# Altium schematic sheet RN2483.SchDoc: RN2483 Radio
size A; Date: 2022-02-22; CompanyName: CUInSpace; DrawnBy: Matteo Golin; Engineer: Matteo Golin; Organization: CUInSpace; Revision: B; SheetNumber: 1; SheetTotal: 4
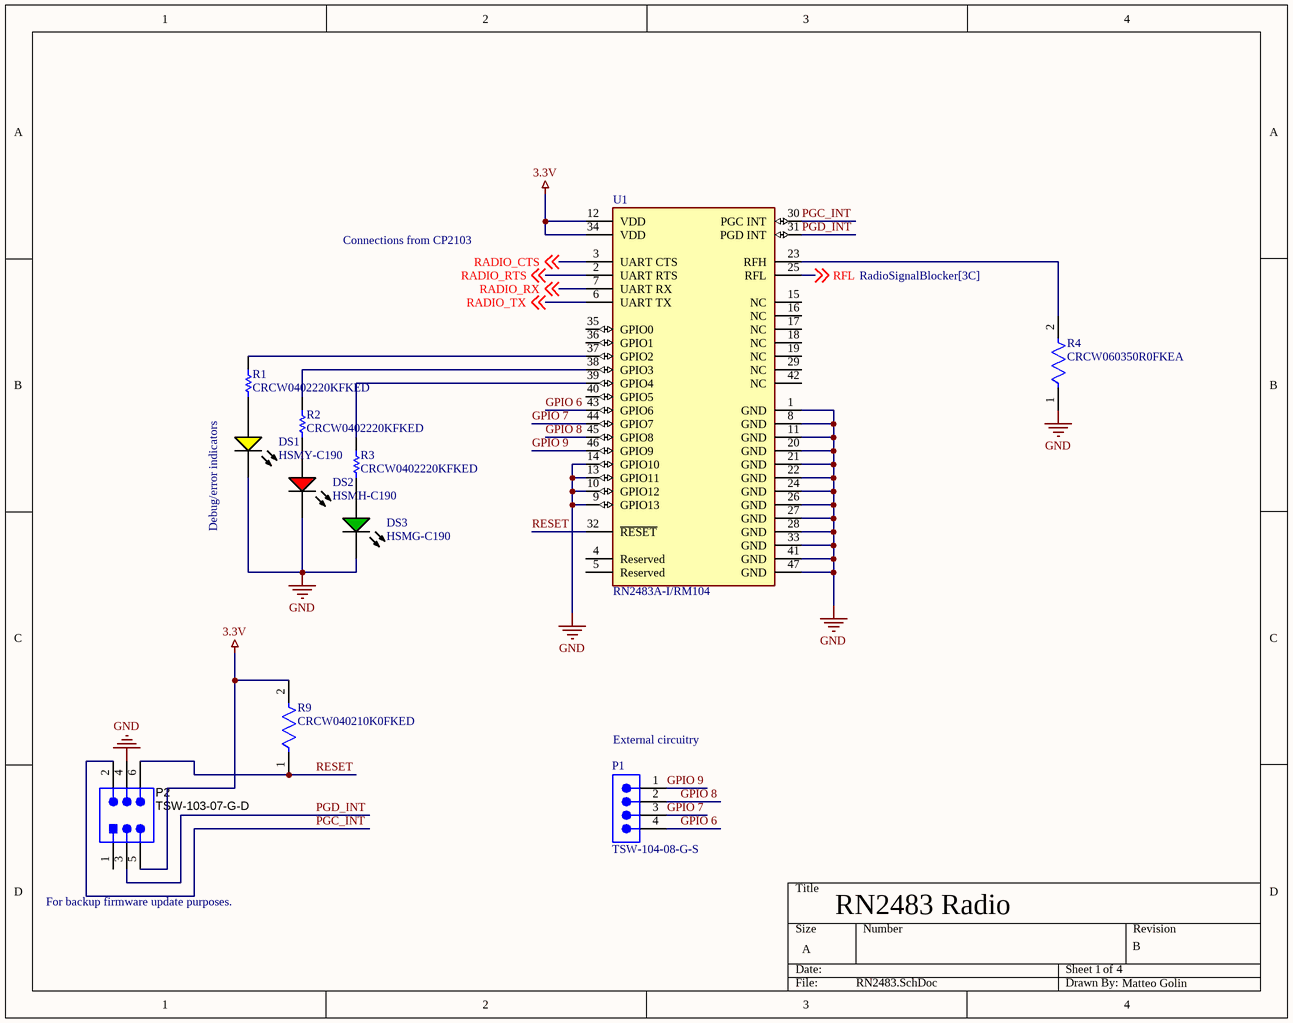
[diagram p0: RN2483.SchDoc]

## Parts
DS1  HSMY-C190  [AVAG-HSMX-C190_V]
DS2  HSMH-C190  [AVAG-HSMX-C190_V]
DS3  HSMG-C190  [AVAG-HSMX-C190_V]
P1  TSW-104-08-G-S  [SMTC-TSW-104-08-X-S]
P2  TSW-103-07-G-D  [SMTC-TSW-103-07-G-D_V]
R1  CRCW0402220KFKED  [RESC1005X40X25LL05T05]
R2  CRCW0402220KFKED  [RESC1005X40X25LL05T05]
R3  CRCW0402220KFKED  [RESC1005X40X25LL05T05]
R4  CRCW060350R0FKEA  [FP-CRCW0603-e3-MFG]
R9  CRCW040210K0FKED  [FP-CRCW0402-e3-IPC_B]
U1  RN2483A-I/RM104  [FP-RN2483A-I-RM104-MFG]

## Nets
3.3V: P2.5 R9.2 U1.12(VDD) U1.34(VDD)
GND: DS1.2(K) DS2.2(K) DS3.2(K) P2.4 R4.1 U1.1(GND) U1.8(GND) U1.9(GPIO13) U1.10(GPIO12) U1.11(GND) U1.13(GPIO11) U1.14(GPIO10) U1.20(GND) U1.21(GND) U1.22(GND) U1.24(GND) U1.26(GND) U1.27(GND) U1.28(GND) U1.33(GND) U1.41(GND) U1.47(GND)
GPIO 6: P1.4 U1.43(GPIO6)
GPIO 7: P1.3 U1.44(GPIO7)
GPIO 8: P1.2 U1.45(GPIO8)
GPIO 9: P1.1 U1.46(GPIO9)
PGC_INT: P2.2 U1.30(PGC_INT)
PGD_INT: P2.3 U1.31(PGD_INT)
RADIO_CTS: U1.3(UART_CTS) ; off-sheet RADIO_CTS
RADIO_RTS: U1.2(UART_RTS) ; off-sheet RADIO_RTS
RADIO_RX: U1.7(UART_RX) ; off-sheet RADIO_RX
RADIO_TX: U1.6(UART_TX) ; off-sheet RADIO_TX
RESET: P2.6 R9.1 U1.32(~{RESET})
RFL: U1.25(RFL) ; off-sheet RFL
NetDS1_1: DS1.1(A) R1.1
NetDS2_1: DS2.1(A) R2.1
NetDS3_1: DS3.1(A) R3.1
NetR1_2: R1.2 U1.37(GPIO2)
NetR2_2: R2.2 U1.38(GPIO3)
NetR3_2: R3.2 U1.39(GPIO4)
NetR4_2: R4.2 U1.23(RFH)

Not connected (* = marked no-connect by the designer): P2 1; U1 4(Reserved) 5(Reserved) 15(NC) 16(NC) 17(NC) 18(NC) 19(NC) 29(NC) 35(GPIO0) 36(GPIO1) 40(GPIO5) 42(NC)

## Notes on the sheet
- Connections from CP2103
- Debug/error indicators
- (near P1) External circuitry
- Type @ to refer to a designator or a net
- For backup firmware update purposes.

## Library data of the parts
DS1 = CMP-1744-00003-1: LED Uni-Color Yellow, 65 mW, 20 mA, -40 to 85 degC, 2-Pin SMD, RoHS, Tape and Reel; Tolerance: 1%; Voltage Rating: 50 V; Power Rating: 100 mW; Case\Package: 0603; Resistance: 390 Ohm; Min Operating Temperature: -55 degC; Length: 1.6 mm; ComponentLink3Description: Package Specification; Mount: Surface Mount; PackageReference: HSMX-C190; ComponentLink2Description: Datasheet; DatasheetVersion: Mar-12; Case Code (Metric): 1608; Pins: 2; Package Quantity: 5000; ComponentLink2URL: http://docs.avagotech.com/docs/AV02-0551EN; ComponentLink1Description: Manufacturer URL; RoHSCompliant: true; Packaging: Tape and Reel; PackageDescription: 2-Pin Surface Mount Device, Body 1.6 x 0.8 mm, Height 0.9 mm; REACH SVHC: No SVHC; ComponentLink3URL: http://www.fairchildsemi.com/dwg/MA/MA03D.pdf; Voltage Rating (DC): 50 V; Width: 0.8 mm; ComponentLink1URL: http://www.avagotech.com/; Max Operating Temperature: 155 degC; Case Code (Imperial): 0603; Height: 0.45 mm
DS2 = CMP-1744-00004-1: LED Uni-Color Red, 65 mW, 20 mA, -40 to 85 degC, 2-Pin SMD, RoHS, Tape and Reel; Connector Type: USB; Gender: Male; Current Rating: 1 A; Length: 7.5 mm; Lead Pitch: 0.65 mm; PackageReference: HSMX-C190; Package Quantity: 2000; Max Operating Temperature: 85 degC; PackageDescription: 2-Pin Surface Mount Device, Body 1.6 x 0.8 mm, Height 0.9 mm; ComponentLink3Description: Package Specification; Mount: Surface Mount; Min Operating Temperature: -30 degC; ComponentLink3URL: http://www.fairchildsemi.com/dwg/MA/MA03D.pdf; ComponentLink1Description: Manufacturer URL; Contact Material: Copper; Pins: 5; Width: 5.6 mm; ComponentLink2Description: Datasheet; RoHSCompliant: true; DatasheetVersion: Mar-12; Height: 2.8 mm; Packaging: Tape and Reel; Contact Plating: Gold; ComponentLink1URL: http://www.avagotech.com/; REACH SVHC: No SVHC; ComponentLink2URL: http://docs.avagotech.com/docs/AV02-0551EN
DS3 = CMP-1744-00002-1: Chip LED, Green, 2.2 V, -40 to 85 degC, 2-Pin SMD, RoHS, Tape and Reel; Frequency: 400 KHz; Max Supply Voltage: 5.5 V; Access Time: 3500 ns; Clock Frequency: 100 KHz; Case\Package: SOIC; Density: 32 kb; Nominal Supply Current: 2 mA; Interface: Serial; Min Supply Voltage: 1.7 V; Packaging: Tape and Reel; PackageReference: HSMX-C190; ComponentLink2URL: http://docs.avagotech.com/docs/AV02-0551EN; RoHSCompliant: true; Pins: 8; REACH SVHC: No SVHC; Max Operating Temperature: 85 degC; Width: 4 mm; Radiation Hardening: No; Package Quantity: 3000; ComponentLink3Description: Package Specification; ComponentLink1Description: Manufacturer URL; Min Operating Temperature: -40 degC; PackageDescription: 2-Pin Surface Mount Device, Body 1.6 x 0.8 mm, Height 0.9 mm; Max Clock Frequency: 100 KHz; Height: 1.5 mm; ComponentLink1URL: http://www.avagotech.com/; DatasheetVersion: Mar-12; ComponentLink2Description: Datasheet; Mount: Surface Mount; Length: 5 mm; ComponentLink3URL: http://www.fairchildsemi.com/dwg/MA/MA03D.pdf
P1 = CMP-1024-00357-1: 0.025" SQ Post Header, Through-hole, Vertical, -55 to 125 degC, 2.54 mm Pitch, 4-Pin, Male, RoHS; Manufacturer: Samtec; Pitch: 2.54 mm; RoHS: True; ComponentLink3URL: http://www.samtec.com/documents/webfiles/cpdf/TSW-XXX-XX-XXX-X-XX-XXX-MKT.pdf; Mounting Technology: Through-hole; ComponentLink2URL: http://www.samtec.com/documents/webfiles/pdf/TSW_TH.PDF; ComponentLink1URL: http://www.samtec.com; ComponentLink3Description: Package Specification; PackageVersion: DM, 8/1988; ComponentLink2Description: Datasheet; PackageReference: TSW-104-08-X-S; PackageDescription: .025[0.64] SQ. Post Terminal Strip Assembly; PartNumber: TSW-104-08-G-S; ComponentLink1Description: Manufacturer URL; Temperature Range: -55 to 125 degC; DatasheetVersion: F-214; Orientation: Vertical
P2 = CMP-2000-07329-1: Through Hole Header, Pitch 2.54 mm, 2 x 3 Position, Height 8.58 mm, Tail Length 2.54 mm, -55 to 125 degC, RoHS, Bulk; Manufacturer: Samtec-Inc.; Number of Positions Loaded: All; Number of Positions: 6; Row Spacing: 0.100"(2.54mm); Connector Type: Header,Unshrouded; Package Reference: TSW-103-07-G-D; Termination: Solder; Manufacturer URL: http://www.samtec.com/; Contact Finish: Gold; Contact Mating Length: 0.230"(5.84mm); Package Description: Through Hole Header, Pitch 2.54 mm, 2 x 3 Position, Height 8.58 mm, Tail Length 2.54 mm; Datasheet Version: 12/2015; Number of Rows: 2; Features: -; Family: RectangularConnectors-Headers,MalePins; Fastening Type: -; Datasheet URL: http://suddendocs.samtec.com/catalog_english/tsw_th.pdf; Category: Connectors,Interconnects; Package URL: http://suddendocs.samtec.com/prints/tsw-xxx-xx-xxx-x-xx-xxx-mkt.pdf; Mounting Type: ThroughHole; Contact Finish Thickness: 10µin(0.25µm); Packaging: Bulk; Color: Black; Pitch: 0.100"(2.54mm); Series: TSW; Contact Type: MalePin; Mounting Technology: ThroughHole
R1-R3 = CMP-2002-08370-1: Manufacturer: Vishay Dale; Part Number: CRCW0402220KFKED
R4 = CMP-2000-03436-2: RES Thick Film, 50Ω, 1%, 0.1W, 100ppm/°C, 0603; Voltage Rating (DC): 75V; Resistance: 50R; Power Rating: 100mW; Case/Package: 0603; Packaging: Tape and Reel; Military Standard: Not; REACH SVHC: No SVHC; Width: 0.85mm; Max Operating Temperature: 155°C; Case Code (Metric): 1608; Temperature Coefficient: 100ppm/°C; Lead Free: Lead Free; Height: 0.45mm; Composition: Thick Film; Termination: SMD/SMT; Contact Plating: Tin; Number of Pins: 2; Tolerance: 1%; Depth: 0.85mm; Weight: 7.1E-05oz; Min Operating Temperature: -55°C; Length: 1.55mm; Radiation Hardening: No; Voltage Rating: 75V; Case Code (Imperial): 0603; Package Quantity: 5000; Mount: Surface Mount
R9 = CMP-2002-08135-2: RES SMD 10K OHM 1% 1/16W 0402; Power Rating: 63mW; Resistance: 10kR; Voltage Rating: 50V; Temperature Coefficient: 100ppm/°C; Case Code (Metric): 1005; Features: Automotive AEC-Q200; Termination: SMD/SMT; Mount: Surface Mount; Package Quantity: 10; Packaging: Tape and Reel; Case Code (Imperial): 0402; Weight: 2.3E-05oz; Lead Free: Lead Free; Width: 0.02inch; Max Power Dissipation: 63mW; Tolerance: 1%; Number of Terminations: 2; Height: 0.35mm; Number of Pins: 2; Composition: Thick Film; Length: 1mm; Voltage Rating (DC): 50V; Case/Package: 0402; Radiation Hardening: No; Contact Plating: Tin; Depth: 0.5mm; Military Standard: Not; Min Operating Temperature: -55°C; Max Operating Temperature: 155°C
U1 = CMP-06331-000004-1: Manufacturer: Microchip; Sensitivity: -146dBm; Transmitting Current: 44.5mA; Interface: I2C,SPI,UART; Max Frequency: 870MHz; Number Of Adc Channels: 13; Number Of Gpio: 14; Min Supply Voltage: 2.1V; Data Rate: 300kbits/s; Max Supply Voltage: 3.6V; Bandwidth: 1.74MHz; Mouser Description: RF Transceiver Module FSK/GFSK/LoRa 434.79MHz/870MHz 3.3V SMD Tray; Temperature Range Low: -40°C; ComponentLink2URL: http://ww1.microchip.com/downloads/en/DeviceDoc/RN2483-Low-Power-Long-Range-LoRa-Technology-Transceiver-Module-Data-Sheet-DS50002346D.pdf; Manufacturer Part Number: RN2483A-I/RM104; Octopart: https://octopart.com/rn2483a-i%2Frm104-microchip-90584481; Package: RN2483A-I/RM104; Digikey Description: RN2483A-I/RM104; Category: UNK; Temperature Range High: +85°C; Device Class L3: Transceivers; Lead Free: Yes; Height: 3.467mm; Temperature: -40°C to +85°C; RoHS: TRUE; Automotive: No; ComponentLink2Description: Datasheet; Device Class L1: Integrated Circuits (ICs); Device Class L2: RF Semiconductors and Devices